# EAGLE design ECE411-Group6-V4 (EAGLE 8.3.2)
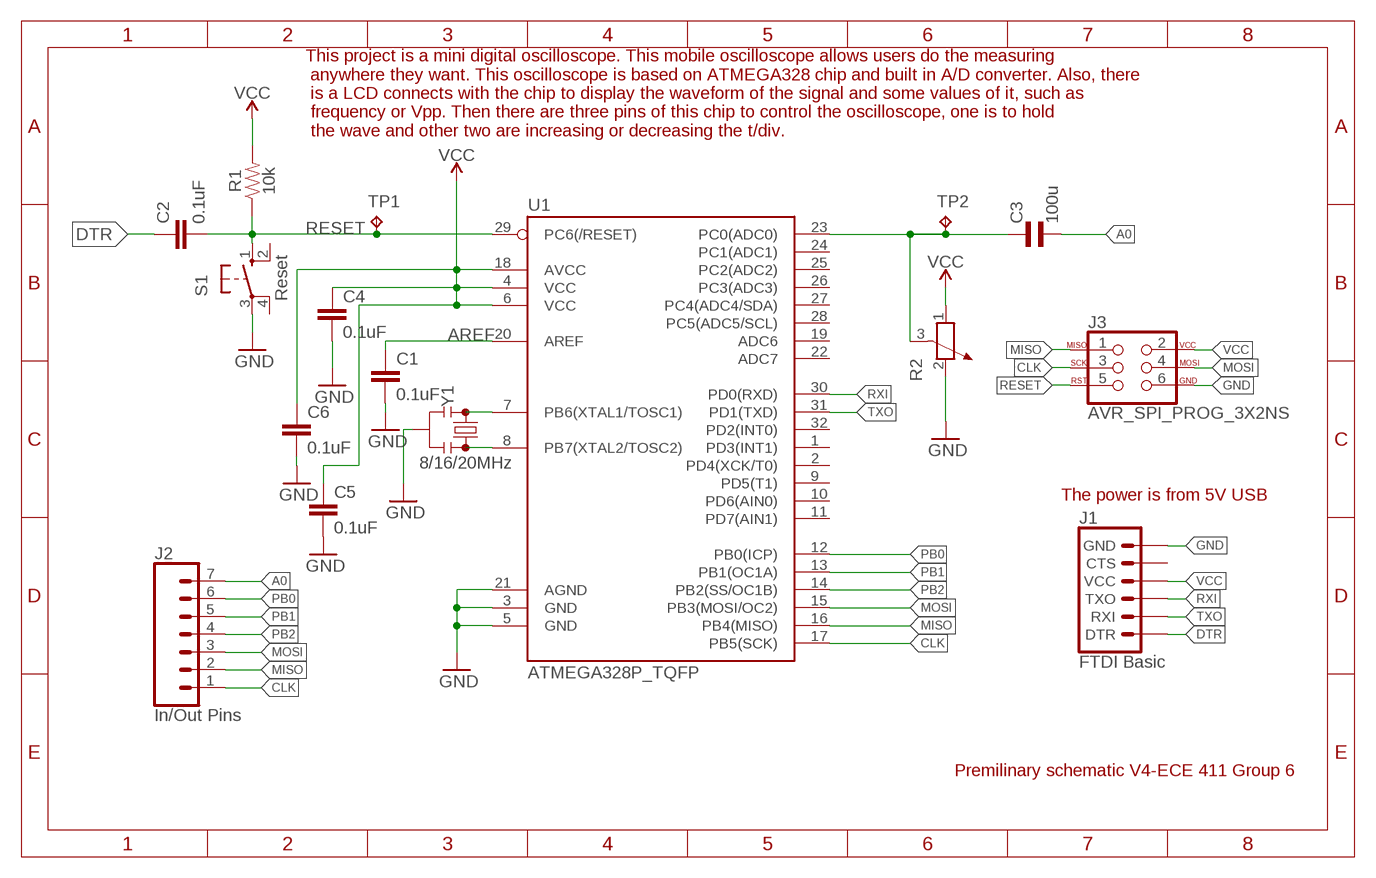
[diagram p0: schematic, sheet 1]

## Parts
C1  0.1uF  0.1UF-0603-25V-5%  [0603]
C2  0.1uF  0.1UF-0603-25V-5%  [0603]
C3  100u  EL-BI25-10AXIAL  [EU25-10]
C4  0.1uF  0.1UF-0603-25V-5%  [0603]
C5  0.1uF  0.1UF-0603-25V-5%  [0603]
C6  0.1uF  0.1UF-0603-25V-5%  [0603]
J1  FTDI Basic  6_PIN_SERIAL_TARGET  [1X06]
J2  In/Out Pins  CONN_07  [1X07]
J3  AVR_SPI_PROG_3X2NS  [2X3-NS]
R1  10k  10KOHM-0603-1/10W-1%  [0603]
R2  POTENTIOMETER_PT-10  [PT-10]
S1  Reset  10-XX  [B3F-10XX]
TP1  TPB1,27  [B1,27]
TP2  TPB1,27  [B1,27]
U1  ATMEGA328P_TQFP  [TQFP32-08]
Y1  8/16/20MHz  RESONATORSMD-3.2X1.3  [RESONATOR-SMD-3.2X1.3]

## Nets
A0: C3.2 J2.7
AREF: C1.1 U1.20(AREF)
CLK: J2.1 J3.3 U1.17(PB5(SCK))
DTR: C2.1 J1.1(DTR)
GND: C1.2 C4.2 C5.2 C6.2 J1.6(GND) J3.6 R2.2 S1.3(P) U1.3(GND) U1.5(GND) U1.21(AGND) Y1.2
MISO: J2.2 J3.1 U1.16(PB4(MISO))
MOSI: J2.3 J3.4 U1.15(PB3(MOSI/OC2))
N$1: U1.7(PB6(XTAL1/TOSC1)) Y1.1
N$2: U1.8(PB7(XTAL2/TOSC2)) Y1.3
N$4: C3.1 R2.3 TP2.TP U1.23(PC0(ADC0))
PB0: J2.6 U1.12(PB0(ICP))
PB1: J2.5 U1.13(PB1(OC1A))
PB2: J2.4 U1.14(PB2(SS/OC1B))
RESET: C2.2 J3.5 R1.1 S1.1(S) TP1.TP U1.29(PC6(/RESET))
RXI: J1.3(TXO) U1.30(PD0(RXD))
TXO: J1.2(RXI) U1.31(PD1(TXD))
VCC: C4.1 C5.1 C6.1 J1.4(VCC) J3.2 R1.2 R2.1 U1.4(VCC) U1.6(VCC) U1.18(AVCC)
Unconnected: J1.5(CTS) S1.2(S1) S1.4(P1) U1.1(PD3(INT1)) U1.2(PD4(XCK/T0)) U1.9(PD5(T1)) U1.10(PD6(AIN0)) U1.11(PD7(AIN1)) U1.19(ADC6) U1.22(ADC7) U1.24(PC1(ADC1)) U1.25(PC2(ADC2)) U1.26(PC3(ADC3)) U1.27(PC4(ADC4/SDA)) U1.28(PC5(ADC5/SCL)) U1.32(PD2(INT0))

## Notes on the sheet
- This project is a mini digital oscilloscope. This mobile oscilloscope allows users do the measuring
   anywhere they want. This oscilloscope is based on ATMEGA328 chip and built in A/D converter. Also, there
   is a LCD connects with the chip to display the waveform of the signal and some values of it, such as
   frequency or Vpp. Then there are three pins of this chip to control the oscilloscope, one is to hold
   the wave and other two are increasing or decreasing the t/div.
- The power is from 5V USB
- Premilinary schematic V4-ECE 411 Group 6

## Library data of the parts
C1 C2 C4-C6 = SparkFun-Capacitors:0.1UF: 0.1µF ceramic capacitors A capacitor is a passive two-terminal electrical component used to store electrical energy temporarily in an electric field.; PROD_ID: CAP-08604
C3 = rcl:EL-: BIPOLAR ELECTROLYTIC CAPACITOR
J1 = SparkFun-Connectors:6_PIN_SERIAL_TARGET: 6-pin header connection for use with the "FTDI BASIC" pinout - TARGET SIDE. Also known as "Arduino Serial Program Header". It is used to mate with our FTDI Basic serial programmers using the Arduino IDE. Note, this device has "TARGET" in the name. It is intended to be used on a design that contains a target micro-controller that you wish to program. The "sister" device, named "CABLE" is inteneded to be used on a design that usually lives on the end of your USB cable and prvides the converter chip (FTDI232 or FTDI231x) to commnicate serial RX/TX. You can populate with some of these: Break Away Headers - Straight <https://www.sparkfun.com/products/116> (PRT-00116) For reference (or to suit your programming needs) check out these designs: SparkFun FTDI Basic Breakout - 5V <https://www.sparkfun.com/products/9716> (DEV-09716) SparkFun FTDI Basic Breakout - 3.3V <https://www.sparkfun.com/products/9873> (DEV-09873) SparkFun FTDI SmartBasic <https://www.sparkfun.com/products/12935> (DEV-12935) SparkFun Beefy 3 - FTDI Basic Breakout <https://www.sparkfun.com/products/13746> (DEV-13746)
J2 = SparkFun-Connectors:CONN_07: Multi connection point. Often used as Generic Header-pin footprint for 0.1 inch spaced/style header connections On any of the 0.1 inch spaced packages, you can populate with these: Break Away Headers - Straight <https://www.sparkfun.com/products/116> (PRT-00116) Break Away Male Headers - Right Angle <https://www.sparkfun.com/products/553> (PRT-00553) Female Headers <https://www.sparkfun.com/products/115> (PRT-00115) Break Away Headers - Machine Pin <https://www.sparkfun.com/products/117> (PRT-00117) Break Away Female Headers - Swiss Machine Pin <https://www.sparkfun.com/products/743> (PRT-00743) For SCREWTERMINALS and SPRING TERMINALS visit here: Screw Terimnals on SparkFun.com <https://www.sparkfun.com/search/results?term=Screw+Terminals> (5mm/3.5mm/2.54mm spacing) This device is also useful as a general connection point to wire up your design to another part of your project. Our various solder wires solder well into these plated through hole pads. Hook-Up Wire - Assortment (Stranded, 22 AWG) <https://www.sparkfun.com/products/11375> (PRT-11375) Hook-Up Wire - Assortment (Solid Core, 22 AWG) <https://www.sparkfun.com/products/11367> (PRT-11367) View the entire wire category on our website here <https://www.sparkfun.com/categories/141> Special notes: Molex polarized connector foot print use with SKU : PRT-08231 with associated crimp pins and housings. 1MM SMD Version SKU: PRT-10208 NOTES ON THE VARIANTS LOCK and LOCK_LONGPADS... This footprint was designed to help hold the alignment of a through-hole component (i.e. 6-pin header) while soldering it into place. You may notice that each hole has been shifted either up or down by 0.005 of an inch from it's more standard position (which is a perfectly straight line). This slight alteration caused the pins (the squares in the middle) to touch the edges of the holes. Because they are alternating, it causes a "brace" to hold the component in place. 0.005 has proven to be the perfect amount of "off-center" position when using our standard breakaway headers. Although looks a little odd when you look at the bare footprint, once you have a header in there, the alteration is very hard to notice. Also,if you push a header all the way into place, it is covered up entirely on the bottom side.
J3 = SparkFun-Connectors:AVR_SPI_PROG_3X2: AVR ISP 6 Pin This is the reduced ISP connector for AVR programming. Common on Arduino. This footprint will take up less PCB space and can be used with a 10-pin to 6-pin adapter such as SKU: BOB-08508 **Special note about "TEST_POINT" package. The stop mask is on the top side, so if you want your programming test points to be on the bottom of your board, make sure to place this package on the bottom side of the board. This also ensure that the orientation to program from the bottom side will be correct. SparkFun Products: SparkFun ISP Pogo Adapter <https://www.sparkfun.com/products/11591> - NS Tiny AVR Programmer <https://www.sparkfun.com/products/11801> -PTH
R1 = SparkFun-Resistors:10KOHM: 10kΩ resistor A resistor is a passive two-terminal electrical component that implements electrical resistance as a circuit element. Resistors act to reduce current flow, and, at the same time, act to lower voltage levels within circuits. - Wikipedia; PROD_ID: RES-00824
R2 = rcl:POTENTIOMETER_: Potentiometer
S1 = switch-omron:10-XX: OMRON SWITCH; MPN: B3F-1000; OC_FARNELL: 176432; OC_NEWARK: 36M3542
TP1 TP2 = testpad:TP: Test pad
U1 = SparkFun-IC-Microcontroller:ATMEGA328P_TQFP: Popular 328P in QFP Storefront component: ATmega328 - TQFP <https://www.sparkfun.com/products/13448> (COM-13448) Datasheet <http://www.sparkfun.com/datasheets/Components/SMD/ATMega328.pdf> SparkFun Products SparkFun RedBoard - Programmed with Arduino <https://www.sparkfun.com/products/12757> (DEV-12757) Arduino Pro Mini 328 - 5V/16MHz <https://www.sparkfun.com/products/11113> (DEV-11113) Arduino Pro Mini 328 - 3.3V/8MHz <https://www.sparkfun.com/products/11114> (DEV-11114) SparkFun OpenLog <https://www.sparkfun.com/products/13712> (DEV-13712) SparkFun MicroView - OLED Arduino Module <https://www.sparkfun.com/products/12923> (DEV-12923) SparkFun Digital Sandbox <https://www.sparkfun.com/products/12651> (DEV-12651) SparkFun PicoBoard <https://www.sparkfun.com/products/11888> (WIG-11888) Arduino Fio <https://www.sparkfun.com/products/10116> (DEV-10116) LilyPad Arduino 328 Main Board <https://www.sparkfun.com/products/13342> (DEV-13342) SparkFun RedStick <https://www.sparkfun.com/products/13741> (DEV-13741) LilyPad MP3 <https://www.sparkfun.com/products/11013> (DEV-11013) LilyPad Arduino SimpleSnap <https://www.sparkfun.com/products/10941> (DEV-10941) SparkFun Stepoko <https://www.sparkfun.com/products/13899> (ROB-13899) SparkFun Geiger Counter <https://www.sparkfun.com/products/11345> (SEN-11345) SparkFun EL Sequencer <https://www.sparkfun.com/products/12781> (COM-12781) Arduino Pro 328 - 5V/16MHz <https://www.sparkfun.com/products/10915> (DEV-10915) CryptoCape <https://www.sparkfun.com/products/12773> (DEV-12773) SparkFun IR Thermometer Evaluation Board - MLX90614 <https://www.sparkfun.com/products/10740> (SEN-10740) SparkFun RedBot Mainboard <https://www.sparkfun.com/products/12097> (ROB-12097) Arduino Pro 328 - 3.3V/8MHz <https://www.sparkfun.com/products/10914> (DEV-10914) SparkFun Block for Intel® Edison - Arduino <https://www.sparkfun.com/products/13036> (DEV-13036) SparkFun Simon Says - Surface Mount Soldering Kit <https://www.sparkfun.com/products/10935> (KIT-10935) SparkFun 7-Segment Serial Display - Red <https://www.sparkfun.com/products/11441> (COM-11441) SparkFun 7-Segment Serial Display - White <https://www.sparkfun.com/products/11629> (COM-11629) SparkFun 7-Segment Serial Display - Yellow <https://www.sparkfun.com/products/11443> (COM-11443) SparkFun 7-Segment Serial Display - Kelly Green <https://www.sparkfun.com/products/11440> (COM-11440) SparkFun 7-Segment Serial Display - Blue <https://www.sparkfun.com/products/11442> (COM-11442) SparkFun OpenSegment Serial Display - 20mm (Blue) <https://www.sparkfun.com/products/11647> (COM-11647) SparkFun OpenSegment Serial Display - 20mm (Green) <https://www.sparkfun.com/products/11646> (COM-11646) SparkFun OpenSegment Serial Display - 20mm (White) <https://www.sparkfun.com/products/11648> (COM-11648) SparkFun OpenSegment Serial Display - 20mm (Red) <https://www.sparkfun.com/products/11644> (COM-11644) SparkFun OpenSegment Serial Display - 20mm (Yellow) <https://www.sparkfun.com/products/11645> (COM-11645) SparkFun OpenSegment Shield <https://www.sparkfun.com/products/13190> (DEV-13190); PROD_ID: IC-09069
Y1 = SparkFun-Clocks:RESONATOR: Resonators (Generic) Ceramic resonators are clock-generating components, often used to control timing in microcontrollers. They usually have 3 pins: two pins for oscillation, and one pin for ground. Compared to crystals, resonators have worse tolerance, but are usually much cheaper. Plus, they have built-in load capacitors! These devices are used on boards like the Arduino Pro 8MHz <https://www.sparkfun.com/products/11114> and Arduino Pro 16MHz <https://www.sparkfun.com/products/11113>.

## Board
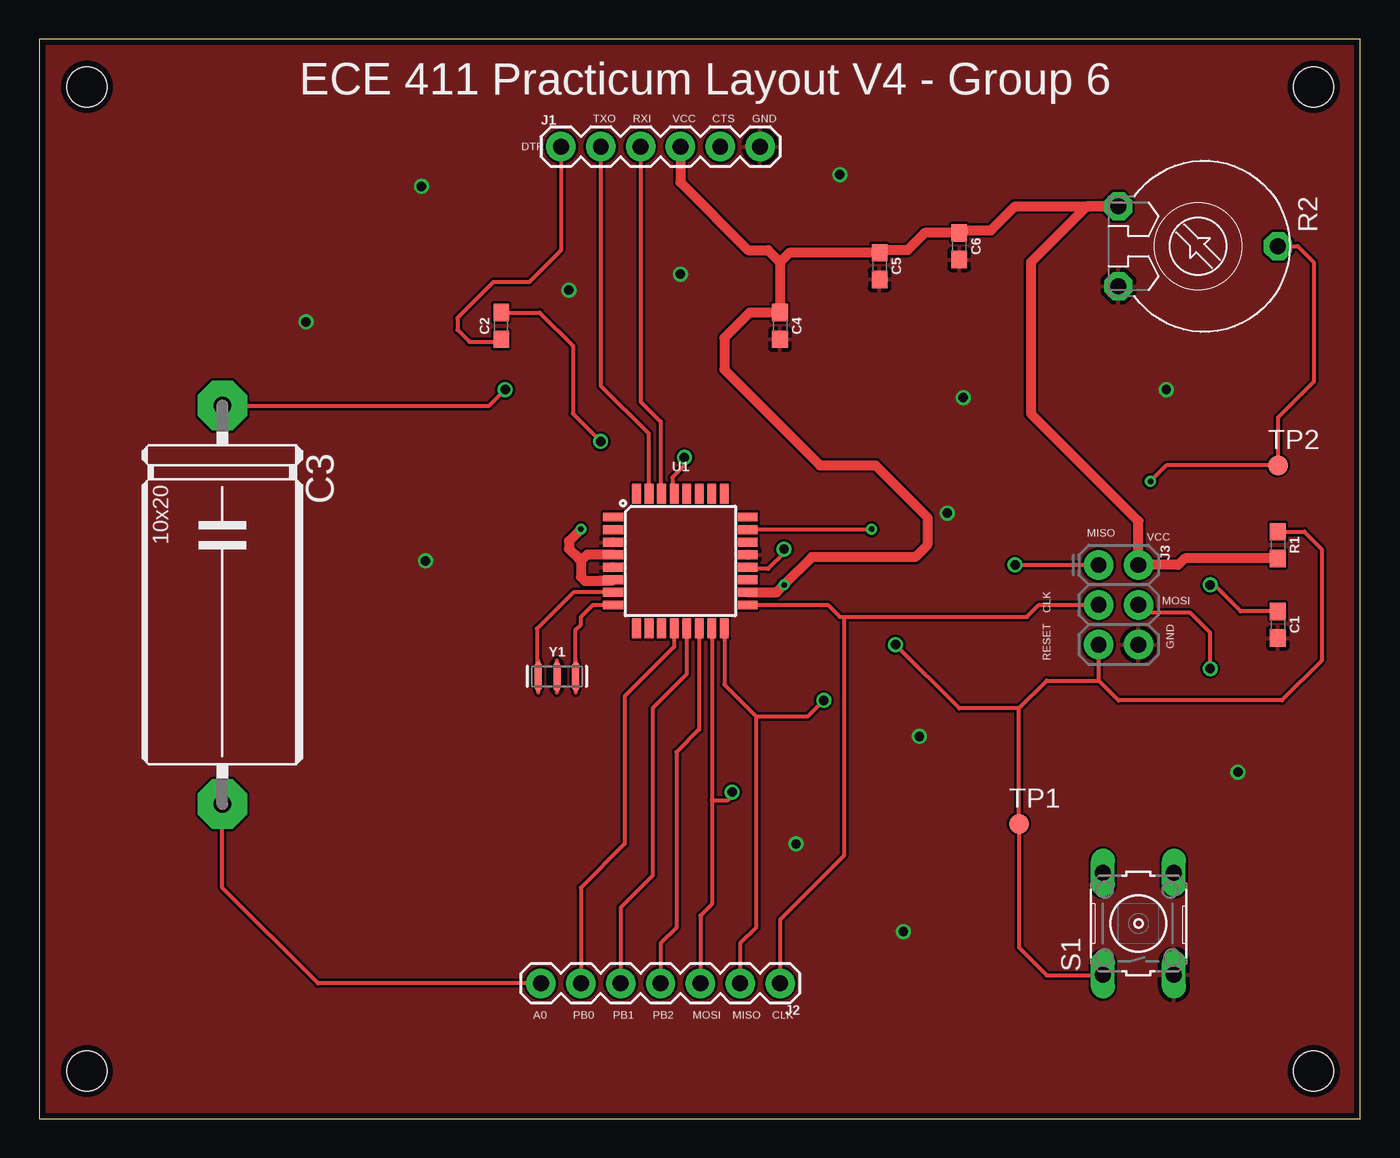
[diagram p1: board, top side]
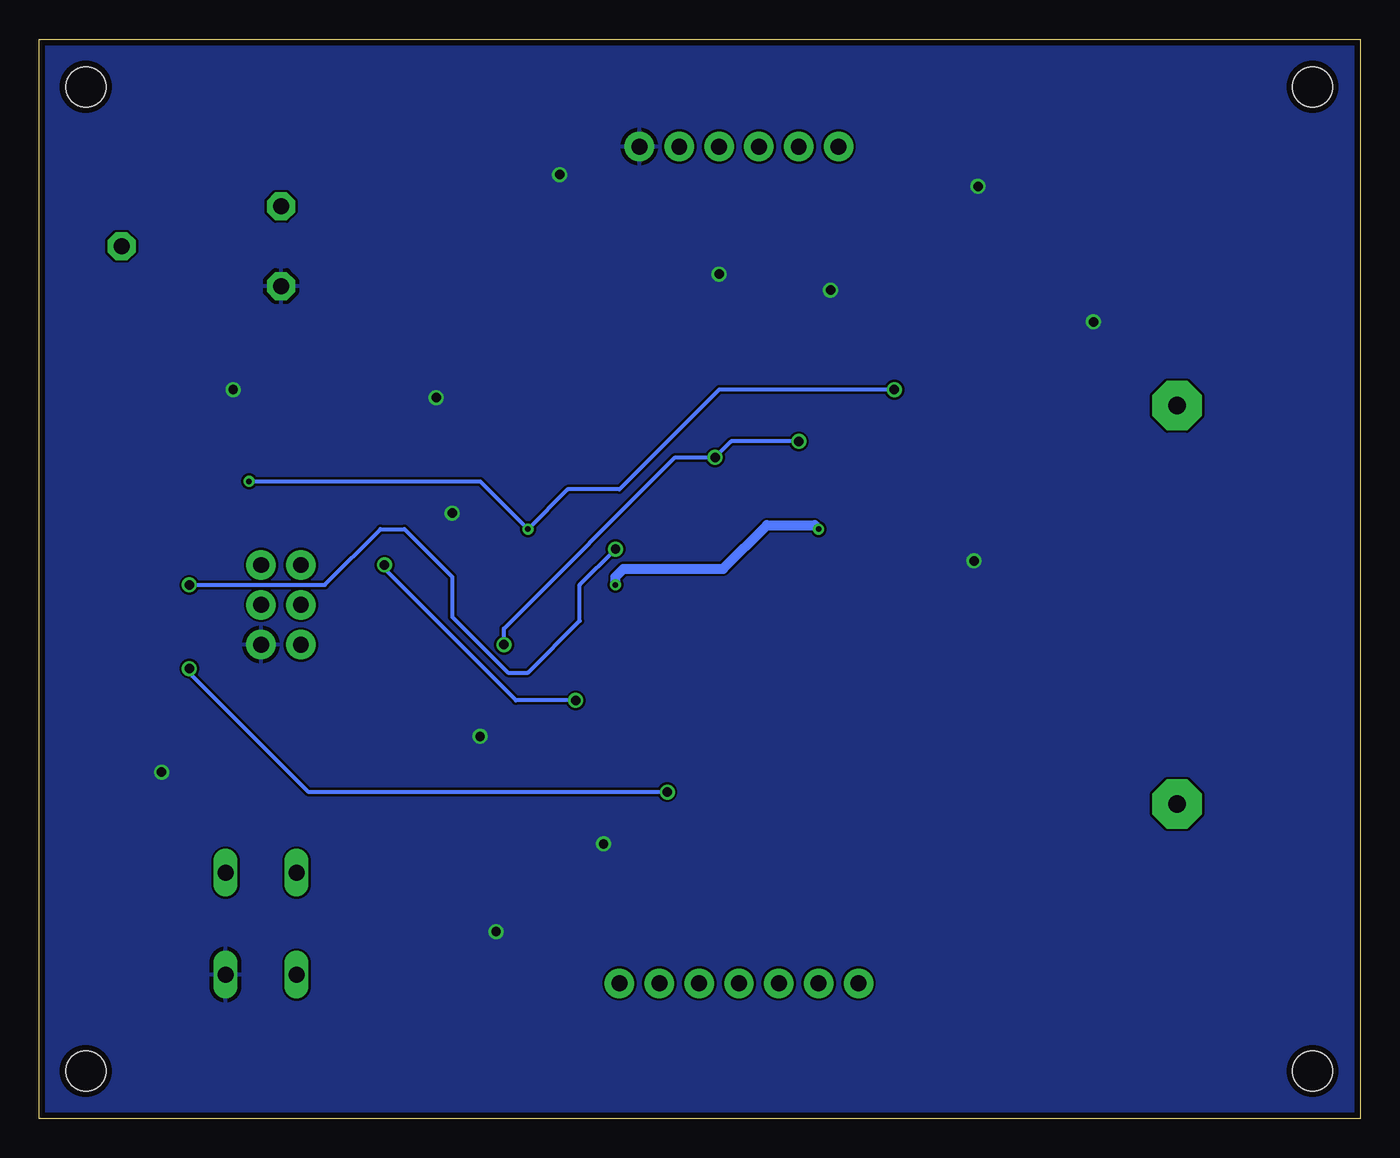
[diagram p2: board, bottom side, seen from below]

Size 84.25 x 68.82 mm. Coordinates in mm from the lower left corner, seen from the top.
Outline: 0,0 84.25,0 84.25,68.82 0,68.82 0,0
Copper layers (1*16): Top 0.0356mm / dielectric 1.5011mm / Bottom 0.0356mm
Design rules "osh-park-2-layers-design-rules": minimum track width 6mil, minimum drill 10mil, track to track 6mil, track to pad 6mil, pad to pad 6mil, via to via 6mil, smd to smd 6mil, copper to edge 15mil, drill to drill 6mil, minimum pad ring 7mil, minimum via ring 7mil, stop-mask expansion 3mil, vias tented up to drill 0mil, thermal gap 10mil
Holes 2.54 mm at 3.05,65.79 3.05,3.05 81.28,3.05 81.28,65.79

### Footprints (pad centres in the part's own frame; a part is rotated, then mirrored left to right if it is on the bottom)
0603 = smd 1.1 x 1: 1 -0.85,0; 2 0.85,0
EU25-10 = drill 1.118 pad 3.15 octagon: 1 -12.7,0; 2 12.7,0
1X06 = drill 1.016 pad 1.88: 1 0,0; 2 2.54,0; 3 5.08,0; 4 7.62,0; 5 10.16,0; 6 12.7,0
1X07 = drill 1.016 pad 1.88: 1 0,0; 2 2.54,0; 3 5.08,0; 4 7.62,0; 5 10.16,0; 6 12.7,0; 7 15.24,0
2X3-NS = drill 1.016 pad 1.88: 1 -2.54,-1.27; 2 -2.54,1.27; 3 0,-1.27; 4 0,1.27; 5 2.54,-1.27; 6 2.54,1.27
PT-10 = drill 1.016 pad 1.778 octagon: 1 -2.54,-5.08; 2 2.54,-5.08; 3 0,5.08
B3F-10XX = drill 1.016 long: 1 -3.251,2.261; 2 3.251,2.261; 3 -3.251,-2.261; 4 3.251,-2.261
B1,27 = smd 1.27 x 1.27: TP 0,0
TQFP32-08 = smd 1.27 x 0.559: 1 -4.293,2.8; 2 -4.293,2; 3 -4.293,1.2; 4 -4.293,0.4; 5 -4.293,-0.4; 6 -4.293,-1.2; 7 -4.293,-2; 8 -4.293,-2.8; 17 4.293,-2.8; 18 4.293,-2; 19 4.293,-1.2; 20 4.293,-0.4; 21 4.293,0.4; 22 4.293,1.2; 23 4.293,2; 24 4.293,2.8 | smd 0.559 x 1.27: 9 -2.8,-4.293; 10 -2,-4.293; 11 -1.2,-4.293; 12 -0.4,-4.293; 13 0.4,-4.293; 14 1.2,-4.293; 15 2,-4.293; 16 2.8,-4.293; 25 2.8,4.293; 26 2,4.293; 27 1.2,4.293; 28 0.4,4.293; 29 -0.4,4.293; 30 -1.2,4.293; 31 -2,4.293; 32 -2.8,4.293
RESONATOR-SMD-3.2X1.3 = smd 0.45 x 1.905: 1 -1.2,0; 2 0,0; 3 1.2,0

### Placement (x,y rotation side)
C1  78.99,31.5 270 top
C2  29.46,50.55 90 top
C3  11.68,32.77 270 top
C4  47.24,50.55 270 top
C5  53.59,54.36 270 top
C6  58.67,55.63 270 top
J1  33.27,61.98 0 top
J2  47.24,8.64 180 top
J3  68.83,32.77 270 top
R1  78.99,36.58 270 top
R2  73.91,55.63 270 top
S1  70.1,12.45 90 top
TP1  62.48,18.8 0 top
TP2  78.99,41.66 0 top
U1  40.89,35.56 0 top
Y1  33.02,28.19 0 top

### Tracks (layer width: path | path; a pad name or v marks a point on that pad's centre or on a via)
A0
  Top 0.254: J2.7 17.78,8.64 11.68,14.73 C3.2
AREF  (via drill 0.6)
  Top 0.254: C1.1 76.62,32.35 74.93,34.04 v74.68,34.04 | v47.5,36.32 47.5,36.07 46.48,35.05 45.3,35.05 U1.20
  Bottom 0.254: v74.68,34.04 66.04,34.04 62.48,37.59 60.96,37.59 57.91,34.54 57.91,32 54.36,28.45 53.09,28.45 49.78,31.75 49.78,34.04 v47.5,36.32
CLK
  Top 0.254: U1.17 50.3,32.76 51.05,32 51.31,32 | 51.31,32 62.99,32 63.75,32.77 J3.3 | 51.31,32 51.31,16.76 47.24,12.7 J2.1
DTR
  Top 0.254: J1.1 33.27,55.37 31.24,53.34 28.96,53.34 26.67,51.05 26.67,50.29 27.43,49.53 29.3,49.53 C2.1
GND  (via drill 0.6)
  other vias: 17.02,50.8 24.64,35.56 56.13,24.38 58.93,45.97 57.91,38.61 71.88,46.48 76.45,22.1 55.12,11.94 51.05,60.2 40.89,53.85 24.38,59.44 33.78,52.83 48.26,17.53
  pour Top: -0.51,69.34 -0.51,-0.51 84.84,-0.51 84.84,69.34
  pour Bottom: -1.02,69.85 -1.02,-1.02 85.6,-1.02 85.6,69.85
MISO  (via drill 0.6)
  Top 0.254: U1.16 43.69,27.68 45.72,25.65 | 45.72,25.65 45.72,12.19 44.7,11.18 J2.2 | 45.72,25.65 49.02,25.65 v50.04,26.67 | v62.23,35.31 J3.1
  Bottom 0.254: v50.04,26.67 53.85,26.67 62.48,35.31 v62.23,35.31
MOSI  (via drill 0.6)
  Top 0.254: U1.15 42.89,20.32 | 42.89,20.32 42.89,13.68 42.16,12.95 J2.3 | 42.89,20.32 43.94,20.32 44.2,20.57 v44.2,20.83 | v74.68,28.7 74.68,30.99 73.41,32.26 70.61,32.26 J3.4
  Bottom 0.254: v44.2,20.83 67.06,20.83 74.68,28.45 v74.68,28.7
N$1
  Top 0.254: U1.7 34.07,33.56 31.75,31.24 31.75,28.26 Y1.1
N$2
  Top 0.254: Y1.3 34.22,31.17 34.54,31.5 34.54,32 35.31,32.77 36.59,32.77 U1.8
N$4  (via drill 0.35, 0.6)
  Top 0.254: R2.3 80.26,55.63 81.28,54.61 81.28,46.99 78.99,44.7 TP2.TP 71.88,41.66 v70.87,40.64 | v53.09,37.59 45.22,37.59 U1.23 | C3.1 28.7,45.47 v29.72,46.48
  Bottom 0.254: v70.87,40.64 56.13,40.64 v53.09,37.59 50.55,40.13 47.24,40.13 45.72,41.66 40.89,46.48 v29.72,46.48
PB0
  Top 0.254: U1.12 40.49,30.08 37.34,26.92 37.34,17.53 34.54,14.73 J2.6
PB1
  Top 0.254: U1.13 41.29,28.34 39.12,26.16 39.12,15.49 37.08,13.46 J2.5
PB2
  Top 0.254: U1.14 42.09,24.82 40.64,23.37 40.64,12.19 39.62,11.18 J2.4
RESET  (via drill 0.6)
  Top 0.254: R1.1 80.68,37.43 81.79,36.32 81.79,29.21 79.25,26.67 68.83,26.67 67.56,27.94 | 67.56,27.94 J3.5 | 62.48,26.16 TP1.TP 62.48,10.92 64.26,9.14 67.79,9.14 S1.1 | 62.48,26.16 64.26,27.94 67.56,27.94 | C2.2 31.92,51.4 34.04,49.28 34.04,44.96 v35.81,43.18 | v41.15,42.16 41.15,41.66 40.39,40.89 40.39,39.96 U1.29 | 62.48,26.16 58.67,26.16 v54.61,30.23
  Bottom 0.254: v35.81,43.18 40.13,43.18 v41.15,42.16 43.69,42.16 54.61,31.24 v54.61,30.23
RXI
  Top 0.254: J1.3 38.35,45.72 39.62,44.45 39.62,39.92 U1.30
TXO
  Top 0.254: J1.2 35.81,46.74 38.86,43.69 38.86,39.88 U1.31
VCC  (via drill 0.35)
  Top 0.635: J1.4 40.89,59.69 45.21,55.37 46.48,55.37 47.24,54.61 | 47.24,54.61 C4.1 45.3,51.4 43.69,49.78 43.69,47.75 49.78,41.66 53.34,41.66 56.64,38.35 56.64,36.58 55.88,35.81 49.28,35.81 v47.5,34.04 47.02,33.56 U1.18 | 47.24,54.61 47.84,55.21 C5.1 53.76,55.37 55.37,55.37 56.48,56.48 C6.1 58.84,56.64 60.71,56.64 62.23,58.17 R2.1 66.8,58.17 63.25,54.61 63.25,44.96 70.1,38.1 J3.2 72.64,35.31 73.06,35.73 R1.2 | U1.4 34.94,35.96 34.67,35.69 | 34.67,35.69 34.54,35.56 34.54,34.54 34.8,34.29 35.75,34.29 35.77,34.31 36.55,34.31 U1.6 | v34.54,37.59 33.78,36.83 33.78,36.32 34.42,35.69 34.67,35.69
  Bottom 0.635: v47.5,34.04 47.5,34.54 46.99,35.05 40.64,35.05 37.85,37.85 34.8,37.85 v34.54,37.59

### Text on the board
tPlace: ECE 411 Practicum Layout V4 - Group 6 | TXO | RXI | VCC | CTS | GND | DTR | MISO | VCC | MOSI | CLK | GND | RESET | A0 | PB0 | PB1 | PB2 | MOSI | MISO | CLK